# EAGLE design Grove - Directional Light Sensor v1.0 (EAGLE 6.3)
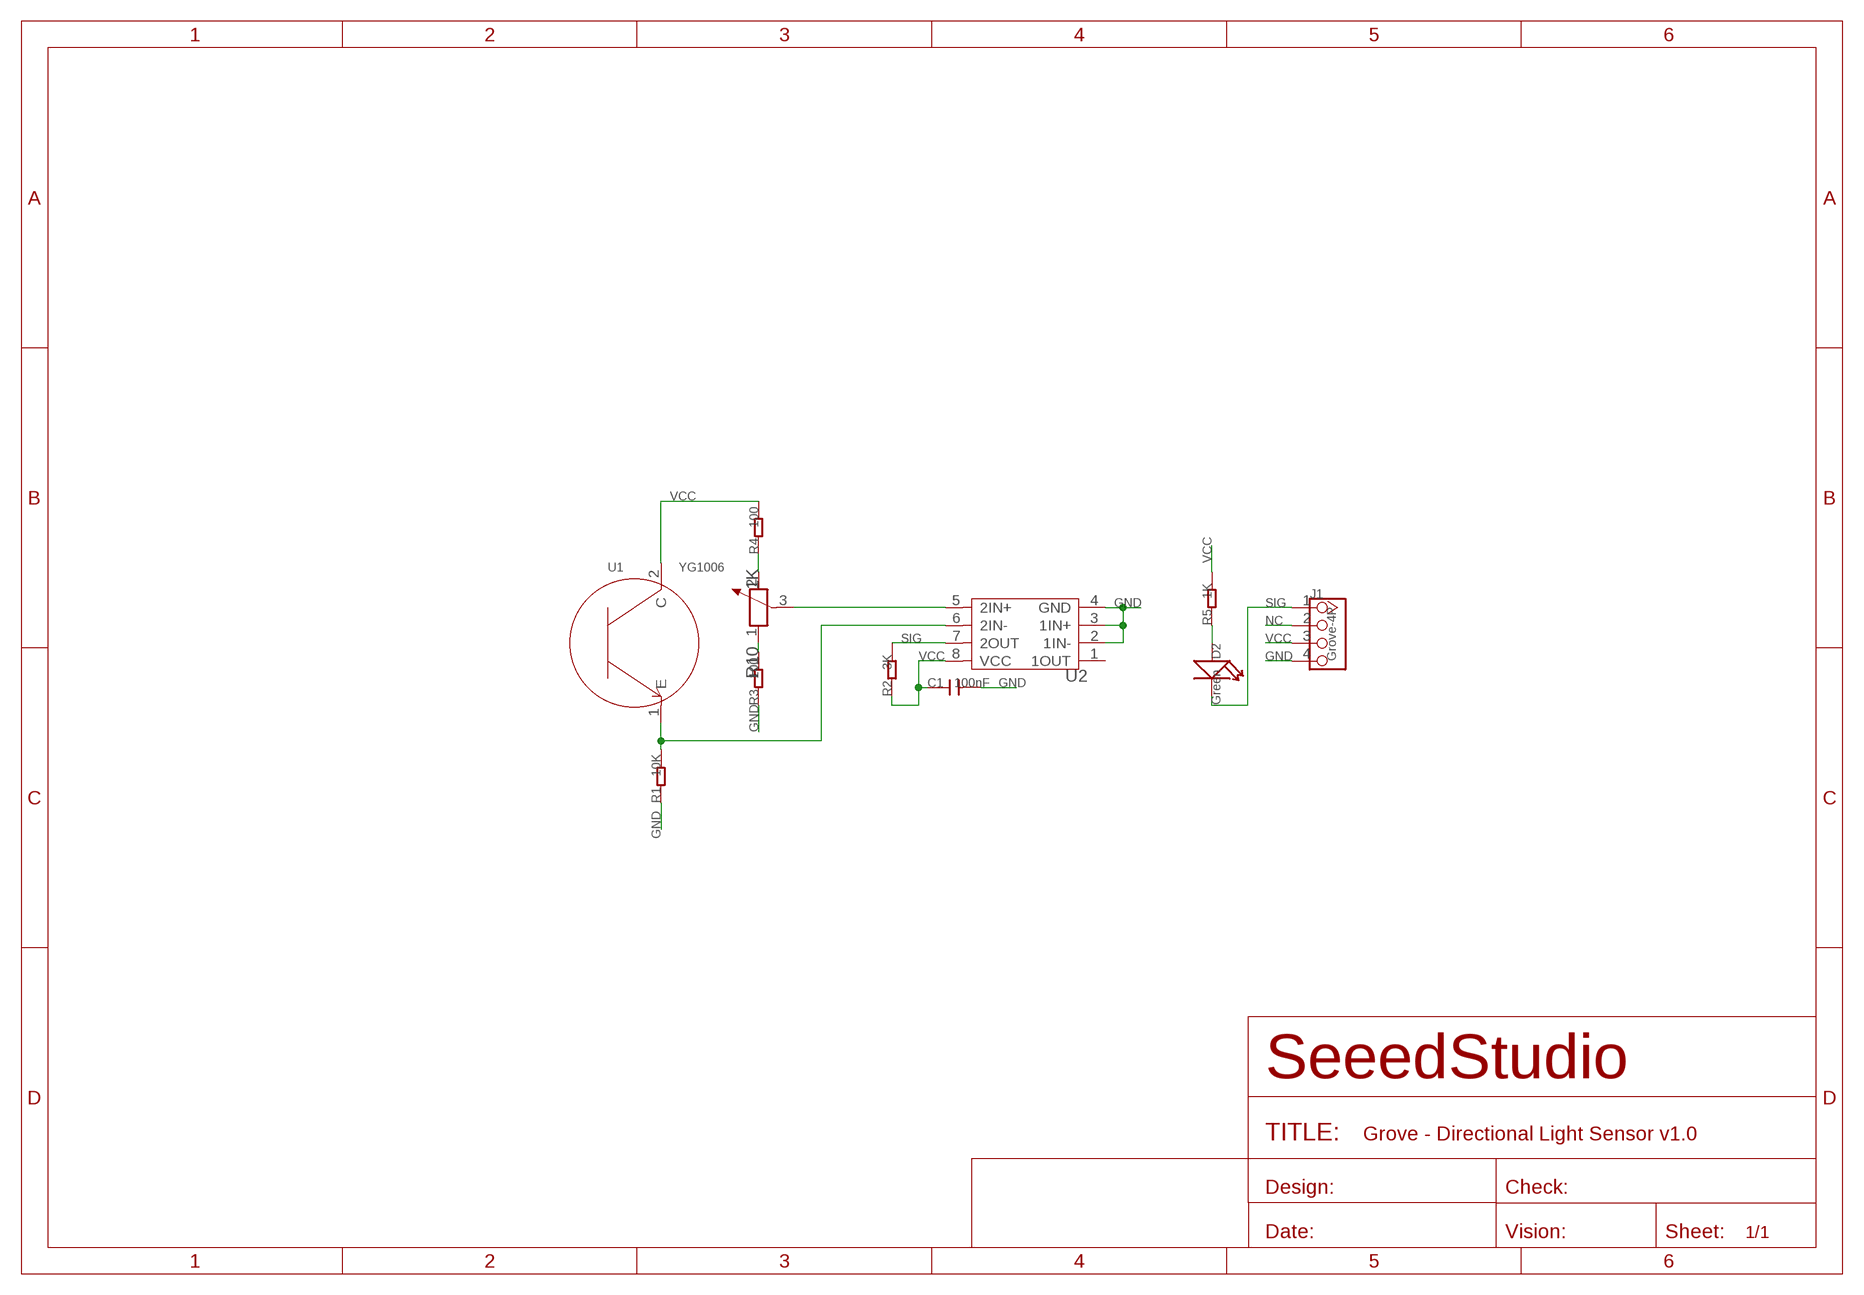
[diagram p0: schematic, sheet 1]

## Parts
C1  100nF  C-0603  [C0603]
D2  Green  LED'0603'  [LED-0603]
J1  Grove-4P  TWIG-4P-2.0-2.0  [4P-2.0]
R1  10K  R-0603  [R0603]
R2  3K  R-0603  [R0603]
R3  100  R-0603  [R0603]
R4  100  R-0603  [R0603]
R5  1K  R-0603  [R0603]
R10  1K  R-POTENTIOMETER'3362'  [3P-SQUA-7X6.8]
U1  YG1006  YG1006'YG1006'  [2P-2.54-5MM]
U2  LM293D  [SOIC8-6.0]

## Nets
GND: C1.2 J1.4 R1.1 R3.1 U2.2(1IN-) U2.3(1IN+) U2.4(GND)
N$1: R1.2 U1.1(E) U2.6(2IN-)
N$2: D2.+ R5.1
N$3: R3.2 R10.1
N$4: R4.1 R10.2
N$5: R10.3 U2.5(2IN+)
NC: J1.2
SIG: D2.- J1.1 R2.2 U2.7(2OUT)
VCC: C1.1 J1.3 R2.1 R4.2 R5.2 U1.2(C) U2.8(VCC)
Unconnected: U2.1(1OUT)

## Library data of the parts
C1 = Discrete:C*: Ceramic Capacitors
D2 = Discrete:LED*
J1 = Connector:TWIG-4P-2.0
R1-R5 = Discrete:R*
R10 = Discrete:R-POTENTIOMETER*: Potentiometer
U1 = template(1):YG1006: YG1006 is a high speed and high sensitive NPN siicon phototransistor in a atandard 5mm package
U2 = IC:LM293: Dual Differential Comparator

## Board
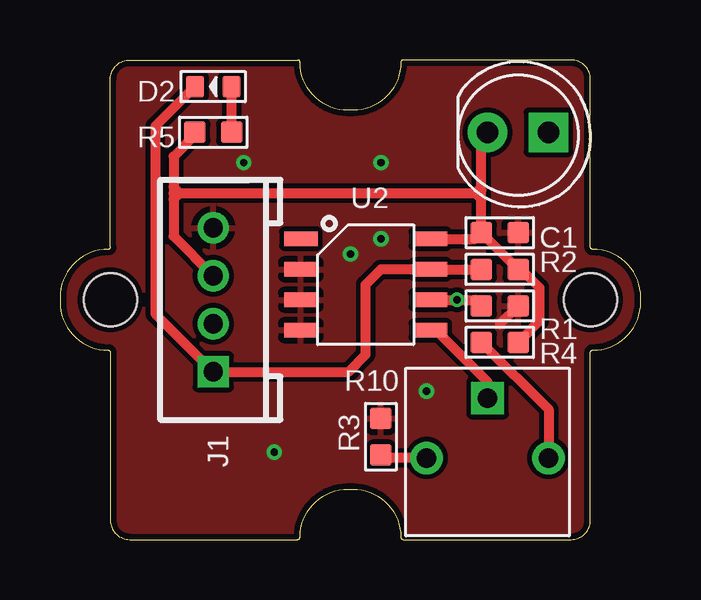
[diagram p1: board, top side]
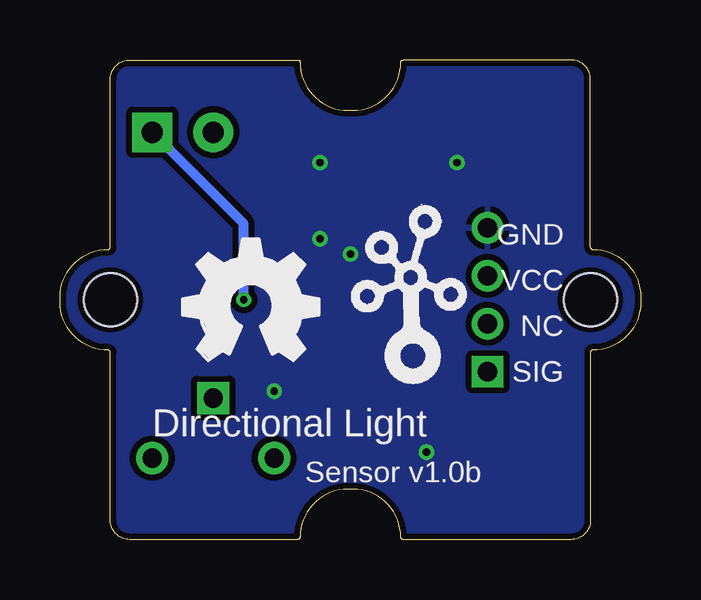
[diagram p2: board, bottom side, seen from below]

Size 24.2 x 20 mm. Coordinates in mm from the lower left corner, seen from the top.
Copper layers (1*16): Top 0.035mm / dielectric 1.5mm / Bottom 0.035mm
Design rules "SeeedStudio_rule_no_angle_090911 *": minimum track width 6mil, minimum drill 12mil, track to track 6mil, track to pad 6mil, pad to pad 6mil, via to via 6mil, smd to smd 0mil, copper to edge 10mil, drill to drill 10mil, minimum pad ring 10mil, minimum via ring 6mil, stop-mask expansion 2mil, vias tented up to drill 25mil, thermal gap 10mil

### Footprints (pad centres in the part's own frame; a part is rotated, then mirrored left to right if it is on the bottom)
C0603 = smd 0.889 x 0.889: 1 -0.762,0; 2 0.762,0
LED-0603 = smd 0.762 x 0.889: + -0.762,0; - 0.762,0
4P-2.0 = drill 0.8 pad 1.27 square: 1 -3,0 | drill 0.8 pad 1.27: 2 -1,0; 3 1,0; 4 3,0
R0603 = smd 0.889 x 0.889: 1 -0.762,0; 2 0.762,0
3P-SQUA-7X6.8 = drill 0.8 pad 1.35: 1 -2.54,-0.25; 2 2.54,-0.25 | drill 0.8 pad 1.35 square: 3 0,2.25
2P-2.54-5MM = drill 0.889 pad 1.651 square: 1 -1.27,0 | drill 0.889 pad 1.651: 2 1.27,0
SOIC8-6.0 = smd 0.6 x 1.4: 1 -1.905,-2.7; 2 -0.635,-2.7; 3 0.635,-2.7; 4 1.905,-2.7; 5 1.905,2.7; 6 0.635,2.7; 7 -0.635,2.7; 8 -1.905,2.7
1U-DIM-W/-DRILL = hole 2.2: 0,-10; 0,10

### Placement (x,y rotation side)
C1  18.32,12.79 0 top
D2  6.38,18.89 180 top
J1  6.38,10 90 top
R1  18.32,9.75 180 top
R2  18.32,11.27 180 top
R3  13.37,4.29 270 top
R4  18.32,8.22 0 top
R5  6.38,16.98 180 top
R10  17.81,3.65 0 top
U1  19.09,16.98 180 top
U2  12.73,10.63 270 top
U$1  [1U-DIM-W/-DRILL]  12.1,10 90 top
U$2  [OSHW_FILLX200_NOTEXT]  19.09,7.46 0 bottom
U$3  [TWIGLOGO]  9.56,7.46 0 bottom

### Tracks (layer width: path | path; a pad name or v marks a point on that pad's centre or on a via)
GND  (via drill 0.3 pad 0.64)
  Top 0.406: R1.1 18.32,8.98
  other vias: 13.37,15.71 8.93,3.65 13.37,12.54 15.27,6.19 7.65,15.71 12.1,11.9
  pour Top (isolate 0.203): -0.6,-0.16 24.8,-0.16 24.8,20.16 -0.6,20.16 -0.6,-0.03
  pour Bottom (isolate 0.254): -0.6,-0.16 24.8,-0.16 24.8,20.16 -0.6,20.16 -0.6,-0.03
N$1  (via drill 0.3)
  Top 0.406: U2.6 v16.55,10 17.31,10 R1.2
  Bottom 0.406: v16.55,10 16.55,13.18 U1.1
N$2
  Top 0.406: R5.1 D2.+
N$3
  Top 0.406: R10.1 13.49,3.4 R3.2
N$4
  Top 0.406: R4.1 20.36,5.43 R10.2
N$5
  Top 0.406: U2.5 15.66,8.73 17.81,6.57 R10.3
SIG
  Top 0.406: R2.2 U2.7 13.37,11.27 12.73,10.63 12.73,7.71 12.02,7 J1.1 3.97,9.41 3.97,17.24 D2.-
VCC
  Top 0.406: U2.8 17.31,12.54 C1.1 | C1.1 R2.1 19.21,11.27 19.97,10.51 19.97,9.11 R4.2 | C1.1 17.56,14.19 | 17.56,14.19 17.56,14.57 | 17.56,14.57 17.56,14.7 | 17.56,14.7 17.56,16.73 U1.2 | R5.2 5.62,16.86 4.73,15.97 4.73,14.7 | 4.73,14.7 4.73,14.45 | 4.73,14.45 4.73,14.19 | 4.73,14.19 4.73,12.65 J1.3 | 4.73,14.45 4.99,14.45 | 4.99,14.45 17.05,14.45 17.31,14.45 | 17.31,14.45 17.43,14.45 17.56,14.57 | 4.99,14.45 4.73,14.7 | 4.99,14.45 4.73,14.19 | 17.31,14.45 17.56,14.7 | 17.31,14.45 17.56,14.19

### Text on the board
bPlace: GND | VCC | NC | SIG | Directional Light | Sensor v1.0b